# EAGLE design L3GD20 (EAGLE 7.1.0)
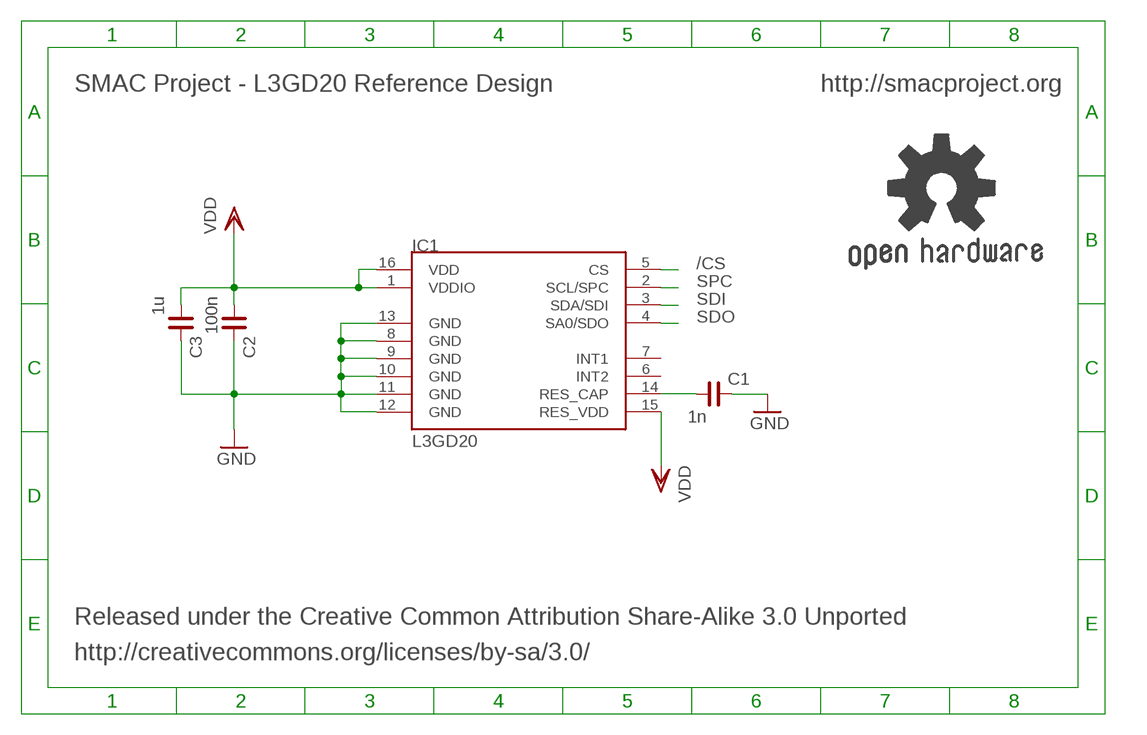
[diagram p0: schematic, sheet 1]

## Parts
C1  1n  C_0402  [C0402]
C2  100n  C_0402  [C0402]
C3  1u  C_0402  [C0402]
GOLD_ORB_SM2  OSHWLOGO_REF_SM  [OSHW2REF]
IC1  L3GD20  [LGA16-4X4]

## Nets
/CS: IC1.5(CS)
GND: C1.2 C2.2 C3.2 IC1.8(GND) IC1.9(GND) IC1.10(GND) IC1.12(GND) IC1.13(GND)
N$4: C1.1 IC1.14(RES_CAP)
SDI: IC1.3(SDA/SDI)
SDO: IC1.4(SA0/SDO)
SPC: IC1.2(SCL/SPC)
VDD: C2.1 C3.1 IC1.1(VDDIO) IC1.15(RES_VDD) IC1.16(VDD)
Unconnected: IC1.6(INT2) IC1.7(INT1) IC1.11(GND)

## Notes on the sheet
- SMAC Project - L3GD20 Reference Design | http://smacproject.org
- Released under the Creative Common Attribution Share-Alike 3.0 Unported
- http://creativecommons.org/licenses/by-sa/3.0/

## Library data of the parts
C1-C3 = rc-master-smd:C_: NON-POLARIZED CAP
GOLD_ORB_SM2 = bfl:OSHWLOGO: These are Open-Source Hardware logos.
IC1 = SparkFun-Sensors:L3GD20

## Board
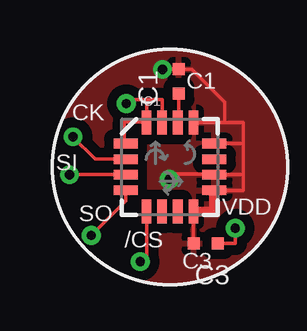
[diagram p1: board, top side]
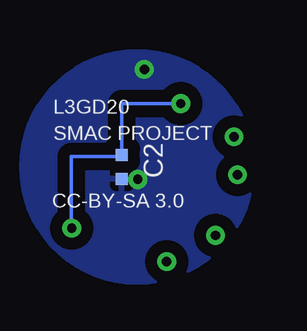
[diagram p2: board, bottom side, seen from below]

No outline drawn. Coordinates in mm, seen from the top.
Copper layers (1*16): Top 0.035mm / dielectric 1.5mm / Bottom 0.035mm
Design rules "default": minimum track width 10mil, minimum drill 0.6mm, track to track 8mil, track to pad 8mil, pad to pad 8mil, via to via 8mil, smd to smd 8mil, copper to edge 40mil, drill to drill 8mil, minimum pad ring 10mil, minimum via ring 8mil, stop-mask expansion 4mil, vias tented up to drill 0mil, thermal gap 10mil

### Footprints (pad centres in the part's own frame; a part is rotated, then mirrored left to right if it is on the bottom)
C0402 = smd 0.5 x 0.5: 1 -0.508,0; 2 0.508,0
LGA16-4X4 = smd 1 x 0.4: 1 -1.85,0.975; 2 -1.85,0.325; 3 -1.85,-0.325; 4 -1.85,-0.975; 9 1.85,-0.975; 10 1.85,-0.325; 11 1.85,0.325; 12 1.85,0.975 | smd 0.4 x 1: 5 -0.975,-1.85; 6 -0.325,-1.85; 7 0.325,-1.85; 8 0.975,-1.85; 13 0.975,1.85; 14 0.325,1.85; 15 -0.325,1.85; 16 -0.975,1.85

### Placement (x,y rotation side)
C1  6.04,9.67 90 top
C2  6.3,6.09 270 bottom
C3  7.16,2.9 180 top
GOLD_ORB_SM2  12.55,2.67 0 top
IC1  5.67,6.09 0 top

### Tracks (layer width: path | path; a pad name or v marks a point on that pad's centre or on a via)
/CS  (via drill 0.38 pad 0.76)
  Top 0.15: IC1.5 4.69,2.4 v4.44,2.15
GND  (via drill 0.38 pad 0.76)
  Top 0.15: IC1.9 8.73,5.12 8.73,5.77 | 8.73,5.77 IC1.10 7.52,5.79 6.8,5.79 5.85,5.79 v5.64,5.58 | IC1.12 8.73,7.07 | 8.73,7.07 8.73,5.77 | IC1.13 8.02,7.94 | 8.02,7.94 8.73,7.94 8.73,7.07 | C3.2 IC1.8 | C1.2 6.04,10.17 | 6.04,10.17 v5.36,10.17 | 6.04,10.17 6.58,10.17 7.95,8.8 7.95,8.02 8.02,7.94
  Top 0.406: IC1.8 7.52,4.24 IC1.9
  Bottom 0.15: C2.2 v5.64,5.58
  pour Bottom (isolate 0.5): 0.82,6.09 arc-90 5.67,10.94 arc-90 10.52,6.09 arc-90 5.67,1.24 arc-90
  pour Top (isolate 0.4): 0.81,6.1 arc-90 5.66,10.95 arc-90 10.51,6.1 arc-90 5.66,1.25 arc-90
N$4
  Top 0.15: C1.1 6.04,7.94 IC1.14
SDI  (via drill 0.38 pad 0.76)
  Top 0.15: v1.48,5.77 v1.49,5.77 IC1.3
SDO  (via drill 0.38 pad 0.76)
  Top 0.15: v2.4,3.24 3.82,4.67 IC1.4
SPC  (via drill 0.38 pad 0.76)
  Top 0.15: v1.63,7.35 2.56,6.42 IC1.2
VDD  (via drill 0.38 pad 0.76)
  Top 0.15: C3.1 8.39,2.9 v8.39,3.54 | IC1.15 | 4.69,8.9 5.34,8.9 IC1.15 | IC1.1 3.77,7.07 3.77,7.96 4.69,7.96 | 4.69,7.96 IC1.16 | IC1.15 | v3.85,8.73 3.85,8.9 4.47,8.9 | 4.47,8.9 4.69,8.9 | 4.69,7.96 4.69,8.9 | 4.69,8.9 4.47,8.9 | IC1.15
  Bottom 0.15: v8.39,3.54 8.4,3.54 8.4,6.53 6.3,6.53 C2.1 6.3,8.73 v3.85,8.73

### Text on the board
tPlace: C1 | CK | SI | SO | VDD | /CS | C3
bPlace: L3GD20 | SMAC PROJECT | CC-BY-SA 3.0
Reference: http://smacproject.org